# EAGLE design infinite_curve (EAGLE 9.6.0)
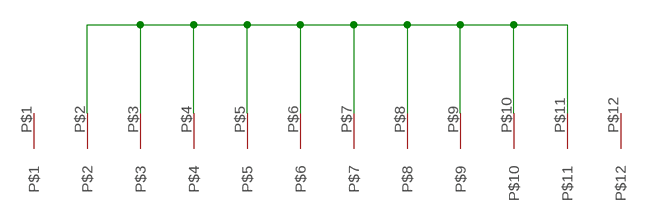
[diagram p0: schematic, sheet 1]

## Parts
U$1  BEAST  [BEAST]

## Nets
N$1: U$1.P$2 U$1.P$3 U$1.P$4 U$1.P$5 U$1.P$6 U$1.P$7 U$1.P$8 U$1.P$9 U$1.P$10 U$1.P$11
Unconnected: U$1.P$1 U$1.P$12

## Library data of the parts
U$1 = beastpins:BEAST

## Board
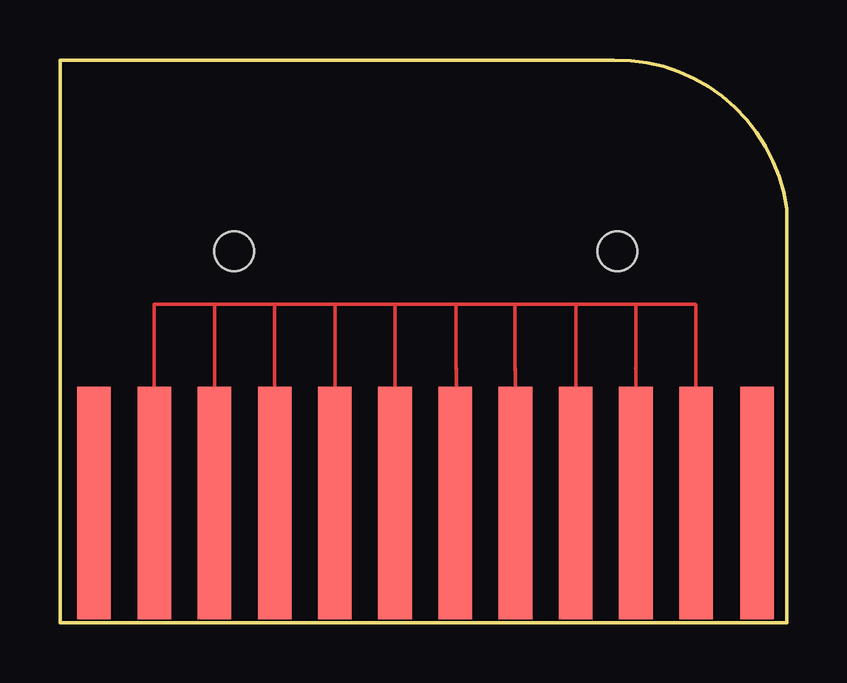
[diagram p1: board, top side]

Size 30.3 x 23.45 mm. Coordinates in mm from the lower left corner, seen from the top.
Outline: 0,0 30.3,0 30.3,17.25 arc83 23.1,23.45 0,23.45 0,0
Copper layers (1*16): Top 0.035mm / dielectric 1.5mm / Bottom 0.035mm
Design rules "default *": minimum track width 6mil, minimum drill 0.35mm, track to track 1mil, track to pad 6mil, pad to pad 6mil, via to via 6mil, smd to smd 6mil, copper to edge 0.002540625mm, drill to drill 1mil, minimum pad ring 10mil, minimum via ring 8mil, stop-mask expansion 4mil, vias tented up to drill 0mil, thermal gap 10mil
Holes 1.65 mm at 7.27,15.49 23.23,15.49

### Footprints (pad centres in the part's own frame; a part is rotated, then mirrored left to right if it is on the bottom)
BEAST = smd 1.4 x 9.7: P$1 -27.61,5.02; P$2 -25.1,5.02; P$3 -22.59,5.02; P$4 -20.08,5.02; P$5 -17.57,5.02; P$6 -15.06,5.02; P$7 -12.55,5.02; P$8 -10.04,5.02; P$9 -7.53,5.02; P$10 -5.02,5.02; P$11 -2.51,5.02; P$12 0.03,5.02

### Placement (x,y rotation side)
U$1  29.03,-0.03 0 top

### Tracks (layer width: path | path; a pad name or v marks a point on that pad's centre or on a via)
N$1
  Top 0.152: 14,5.02 U$1.P$6 13.97,13.26 13.95,13.28 | U$1.P$8 18.99,10.51 | 18.99,10.51 18.99,10.6 | 16.53,10.6 16.53,10.55 | 16.53,10.55 16.53,5.04 U$1.P$7 | U$1.P$4 8.95,10.59 | 8.95,10.59 8.94,10.6 | U$1.P$5 11.46,10.6 | 11.46,10.6 | U$1.P$10 24.01,10.57 | 24.01,10.57 23.98,10.6 | U$1.P$9 21.5,10.6 | 21.5,10.6 | 6.42,13.28 3.94,13.28 3.93,13.27 U$1.P$2 | 6.42,13.28 8.94,13.28 | 8.94,13.28 11.49,13.28 | 11.49,13.28 13.95,13.28 | 13.95,13.28 16.52,13.28 | 16.52,13.28 18.96,13.28 | 18.96,13.28 21.6,13.28 | 21.6,13.28 24.07,13.28 | 24.07,13.28 26.49,13.28 26.52,13.25 U$1.P$11 | 24.01,10.57 24.01,13.22 24.07,13.28 | 21.5,10.6 21.5,13.18 21.6,13.28 | 18.99,10.51 18.96,10.53 18.96,13.28 | 16.53,10.55 16.52,10.56 16.52,13.28 | 11.46,10.6 11.46,13.25 11.49,13.28 | 8.95,10.59 8.95,13.27 8.94,13.28 | 6.42,13.28 6.44,13.25 U$1.P$3